# Altium schematic sheet NO2_Output_Processing.SchDoc
size A4
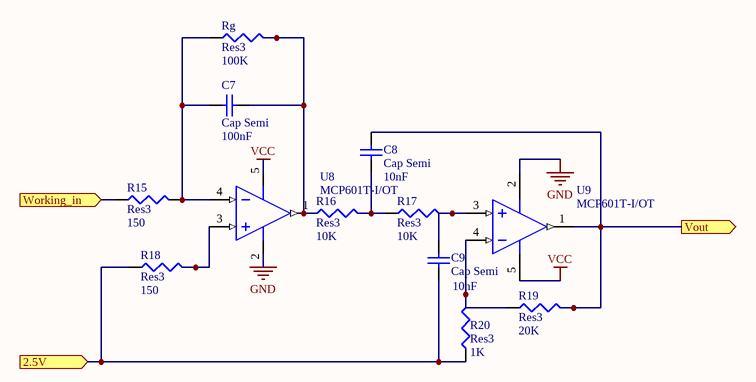
[diagram p0: NO2_Output_Processing.SchDoc]

## Parts
C7  Cap Semi  value 100nF  [C1206]
C8  Cap Semi  value 10nF  [C1206]
C9  Cap Semi  value 10nF  [C1206]
R15  Res3  value 150  [J1-0603]
R16  Res3  value 10K  [J1-0603]
R17  Res3  value 10K  [J1-0603]
R18  Res3  value 150  [J1-0603]
R19  Res3  value 20K  [J1-0603]
R20  Res3  value 1K  [J1-0603]
Rg  Res3  value 100K  [J1-0603]
U8  MCP601T-I/OT  [SOT-23-OT5_L]
U9  MCP601T-I/OT  [SOT-23-OT5_L]

## Ports
2.5V (in), Vout (out), Working_in (in)

## Nets
GND: U8.2(VSS) U9.2(VSS)
VCC: U8.5(VDD) U9.5(VDD)
2.5V: C9.1 R18.1 R20.1 ; port 2.5V
Vout: C8.2 R19.2 U9.1(VOUT) ; port Vout
Working_in: R15.1 ; port Working_in
NetC7_1: C7.1 R15.2 Rg.1 U8.4(VIN-)
NetC7_2: C7.2 R16.1 Rg.2 U8.1(VOUT)
NetC8_1: C8.1 R16.2 R17.1
NetC9_2: C9.2 R17.2 U9.3(VIN+)
NetR18_2: R18.2 U8.3(VIN+)
NetR19_1: R19.1 R20.2 U9.4(VIN-)

## Library data of the parts
C7-C9 = Cap Semi: Capacitor (Semiconductor SIM Model); Published: 8-Jun-2000; LatestRevisionDate: 29-May-2009; LatestRevisionNote: IPC-7351 Footprint Added.; PackageReference: C1206; Publisher: Altium Limited; PackageDescription: Chip Capacitor
R15-R20 Rg = Res3: Resistor; Published: 8-Jun-2000; LatestRevisionDate: 29-May-2009; LatestRevisionNote: IPC-7351 Footprint Added.; PackageReference: J1-0603; Publisher: Altium Limited; PackageDescription: Chip Resistor
U8 U9 = CMP-0187-00433-2: 2.7V to 6.0V Single Supply CMOS Operational Amplifier, 5-Pin SOT-23, Industrial Temperature, Tape and Reel; Code_IPC: SOT23-5; ComponentLink3Description: Package Specification; RevisionNote: URLs added.; PackageReference: SOT-23-OT5; ComponentLink3URL: http://www.microchip.com/stellent/groups/techpub_sg/documents/packagingspec/en012702.pdf; ComponentLink1Description: Manufacturer URL; DatasheetVersion: revG, Dec-2007; PackageDescription: 5-Lead Plastic Small Outline Transistor (OT) [SOT-23]; PackageVersion: revBB, Aug-2009; ComponentLink2Description: Datasheet; ComponentLink1URL: http://www.microchip.com/; ComponentLink2URL: http://ww1.microchip.com/downloads/en/DeviceDoc/21314g.pdf